# Altium project SD5_Keypad.PrjPcb
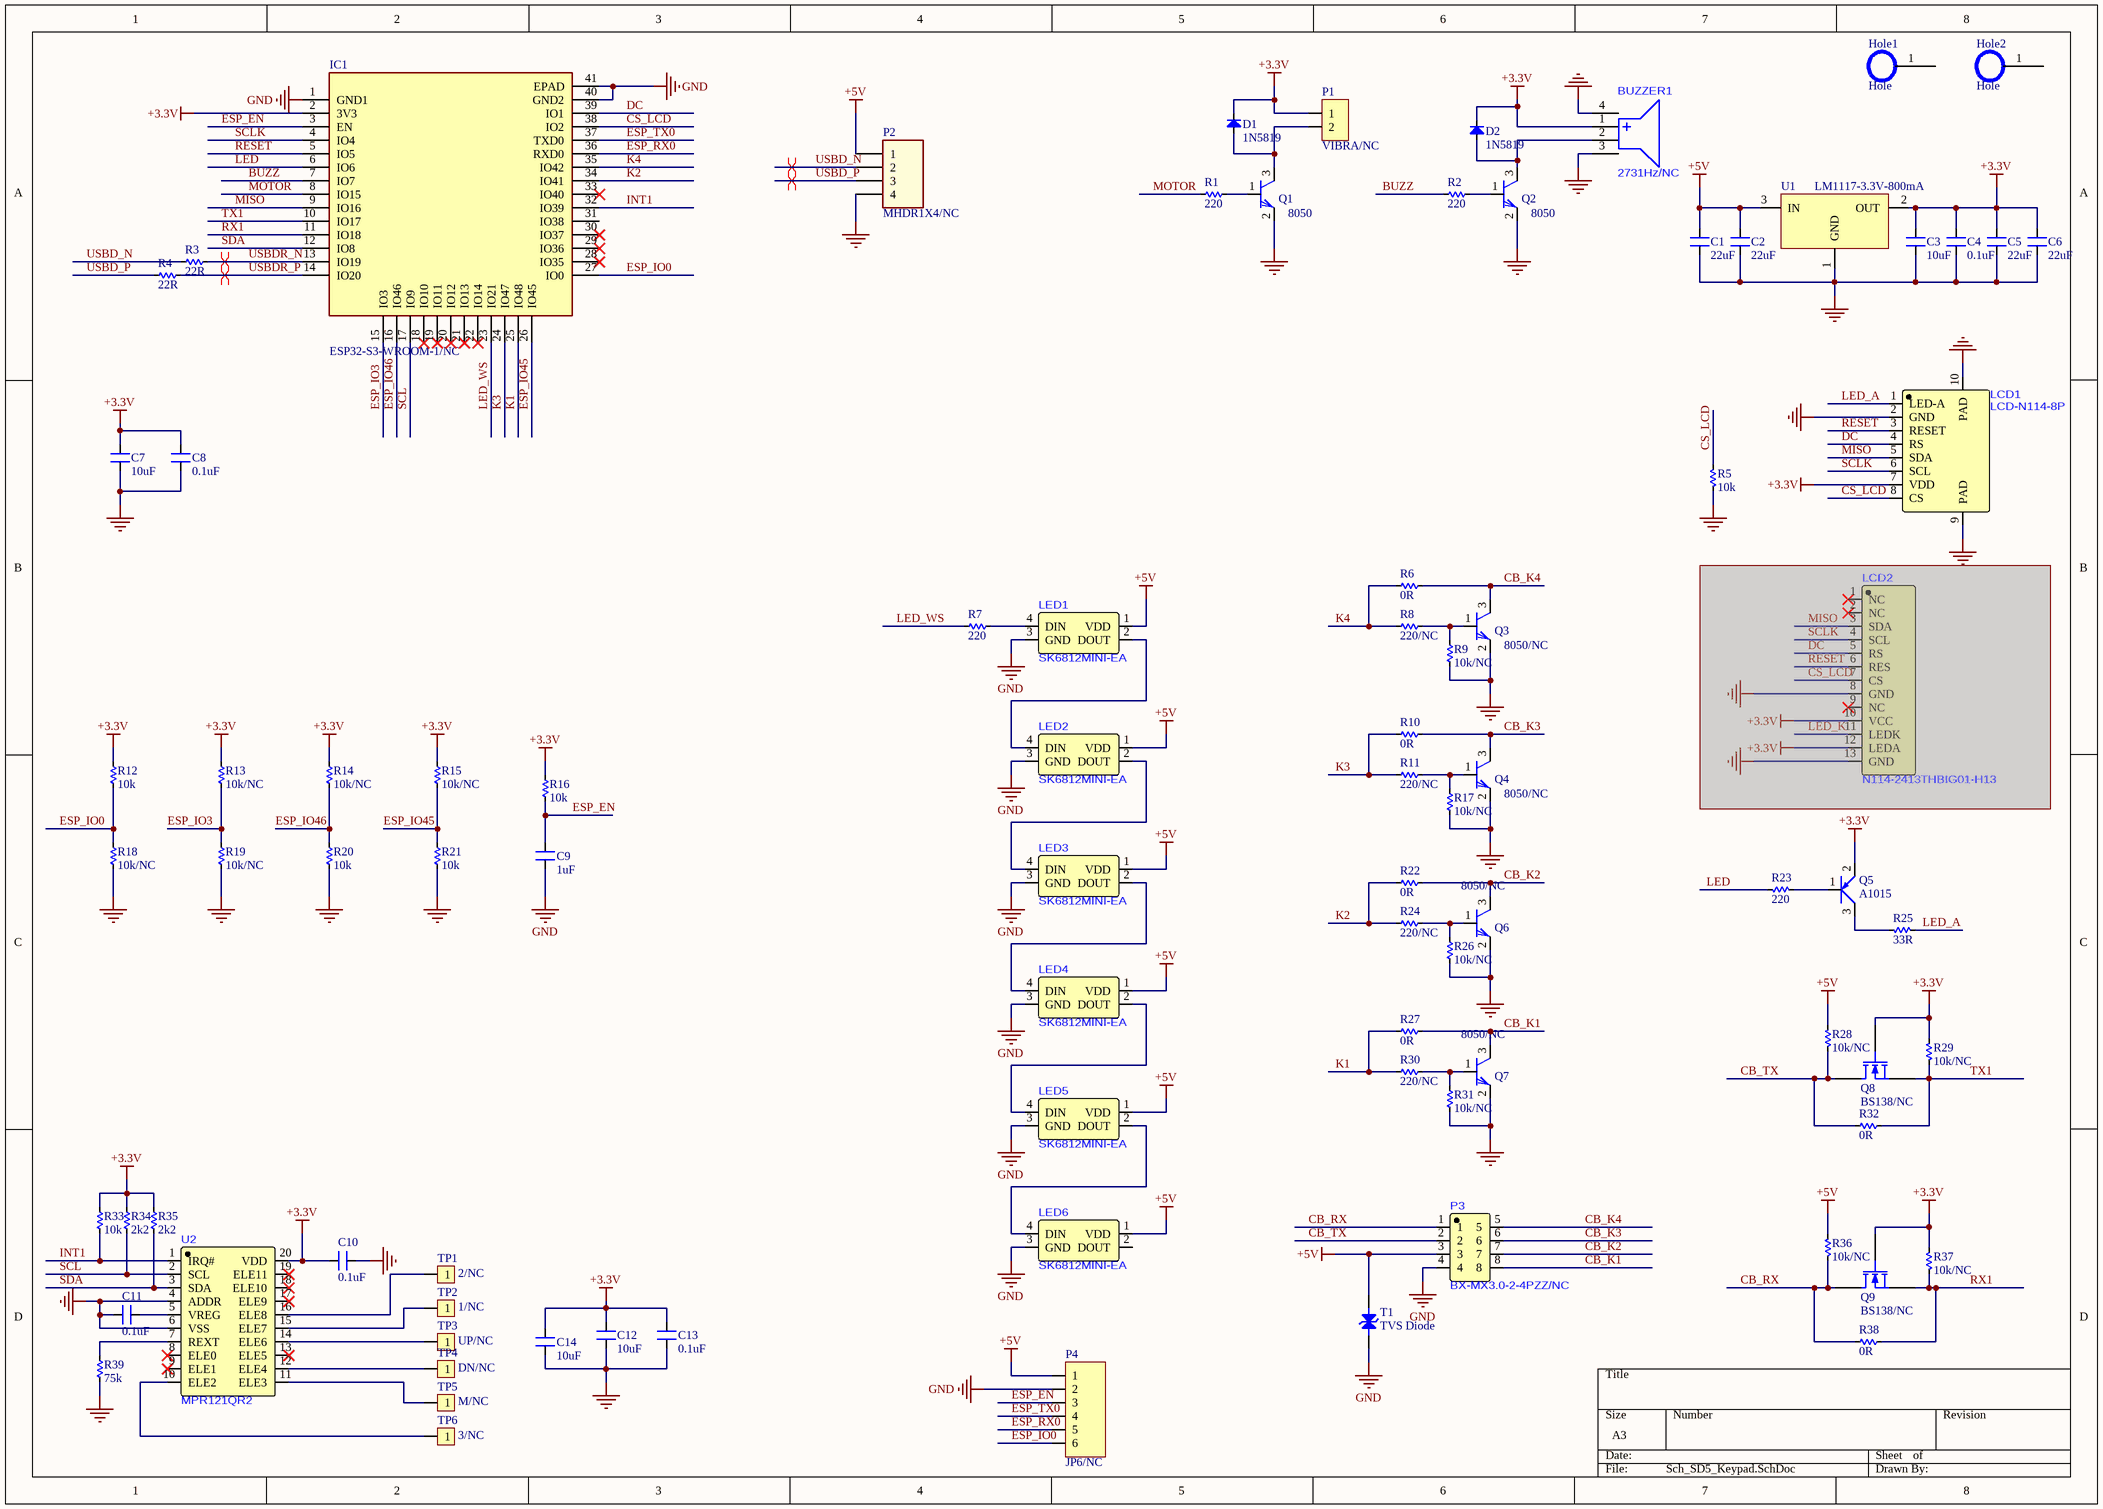
[diagram p0: Sch_SD5_Keypad.SchDoc]
1 sheet, 89 parts. Net scope: global (net labels, ports and power ports of the same name join across sheets).
Board file: PCB_SD5_Keypad_v1.PcbDoc

## Sheet Sch_SD5_Keypad.SchDoc
size A3; SheetNumber: 1; SheetTotal: 1

### Parts
BUZZER1  2731Hz/NC  [BUZ-SMD_4P-L8.5-W8.5-P8.50-TL]
C1  22uF  [C-1206]
C2  22uF  [C-1206]
C3  10uF  [C-0603-2]
C4  0.1uF  [C-0603-2]
C5  22uF  [C-1206]
C6  22uF  [C-1206]
C7  10uF  [C-0603-2]
C8  0.1uF  [C-0603-2]
C9  1uF  [C-0603-2]
C10  0.1uF  [C-0603-2]
C11  0.1uF  [C-0603-2]
C12  10uF  [C-0603-2]
C13  0.1uF  [C-0603-2]
C14  10uF  [C-0603-2]
D1  1N5819  [SOD-123_L2.7-W1.7-LS3.8-RD]
D2  1N5819  [SOD-123_L2.7-W1.7-LS3.8-RD]
Hole1  Hole  [HOLE 2.6mm]
Hole2  Hole  [HOLE 2.6mm]
IC1  ESP32-S3-WROOM-1/NC  [ESP32S3WROOM1N8R2]
LCD1  LCD-N114-8P  [LCD-SMD_1.14IPS-LCD - 8PIN]
LCD2  N114-2413THBIG01-H13  [LCD-SMD_1.14IPS-LCD - 2]  (masked out: inside a compile mask, not in the netlist)
LED1  SK6812MINI-EA  [LED-SMD_4P-L3.2-W2.8_SK6812MINI-EA]
LED2  SK6812MINI-EA  [LED-SMD_4P-L3.2-W2.8_SK6812MINI-EA]
LED3  SK6812MINI-EA  [LED-SMD_4P-L3.2-W2.8_SK6812MINI-EA]
LED4  SK6812MINI-EA  [LED-SMD_4P-L3.2-W2.8_SK6812MINI-EA]
LED5  SK6812MINI-EA  [LED-SMD_4P-L3.2-W2.8_SK6812MINI-EA]
LED6  SK6812MINI-EA  [LED-SMD_4P-L3.2-W2.8_SK6812MINI-EA]
P1  VIBRA/NC  [PAD 2.54]
P2  MHDR1X4/NC  [HDR1X4]
P3  BX-MX3.0-2-4PZZ/NC  [CONN-TH_8P-P3.00_BX-MX3.0-2-4PZZ]
P4  JP6/NC  [JP6-D1T]
Q1  8050  [SOT-23-V2]
Q2  8050  [SOT-23-V2]
Q3  8050/NC  [SOT-23-V2]
Q4  8050/NC  [SOT-23-V2]
Q5  A1015  [SOT-23-V2]
Q6  8050/NC  [SOT-23-V2]
Q7  8050/NC  [SOT-23-V2]
Q8  BS138/NC  [SOT-23-V2]
Q9  BS138/NC  [SOT-23-V2]
R1  220  [R-0603-2]
R2  220  [R-0603-2]
R3  22R  [R-0603-2]
R4  22R  [R-0603-2]
R5  10k  [R-0603-2]
R6  0R  [R-0603-2]
R7  220  [R-0603-2]
R8  220/NC  [R-0603-2]
R9  10k/NC  [R-0603-2]
R10  0R  [R-0603-2]
R11  220/NC  [R-0603-2]
R12  10k  [R-0603-2]
R13  10k/NC  [R-0603-2]
R14  10k/NC  [R-0603-2]
R15  10k/NC  [R-0603-2]
R16  10k  [R-0603-2]
R17  10k/NC  [R-0603-2]
R18  10k/NC  [R-0603-2]
R19  10k/NC  [R-0603-2]
R20  10k  [R-0603-2]
R21  10k  [R-0603-2]
R22  0R  [R-0603-2]
R23  220  [R-0603-2]
R24  220/NC  [R-0603-2]
R25  33R  [R-0603-2]
R26  10k/NC  [R-0603-2]
R27  0R  [R-0603-2]
R28  10k/NC  [R-0603-2]
R29  10k/NC  [R-0603-2]
R30  220/NC  [R-0603-2]
R31  10k/NC  [R-0603-2]
R32  0R  [R-0603-2]
R33  10k  [R-0603-2]
R34  2k2  [R-0603-2]
R35  2k2  [R-0603-2]
R36  10k/NC  [R-0603-2]
R37  10k/NC  [R-0603-2]
R38  0R  [R-0603-2]
R39  75k  [R-0603-2]
T1  TVS Diode  [SMB_L4.6-W3.6-LS5.3-RD]
TP1  2/NC  [TOUCH PAD - 9mm]
TP2  1/NC  [TOUCH PAD - 9mm]
TP3  UP/NC  [TOUCH PAD - 9mm]
TP4  DN/NC  [TOUCH PAD - 9mm]
TP5  M/NC  [TOUCH PAD - 9mm]
TP6  3/NC  [TOUCH PAD - 9mm]
U1  LM1117-3.3V-800mA  [SOT223-LM1117 - duplicate]
U2  MPR121QR2  [QFN-20_L3.0-W3.0-P0.40-BL]

### Nets
+3.3V: BUZZER1.1(+) C3.2 C4.2 C5.2 C6.2 C7.2 C8.2 C10.2 C12.2 C13.2 C14.2 D1.2(K) D2.2(K) IC1.2(3V3) LCD1.7(VDD) P1.1 Q5.2(E) Q8.1(G) Q9.1(G) R12.1 R13.1 R14.1 R15.1 R16.1 R29.1 R33.1 R34.1 R35.1 R37.1 U1.2(OUT) U2.20(VDD)
+5V: C1.2 C2.2 LED1.1(VDD) LED2.1(VDD) LED3.1(VDD) LED4.1(VDD) LED5.1(VDD) LED6.1(VDD) P2.1 P3.3 P4.1 R28.1 R36.1 T1.1 U1.3(IN)
GND: BUZZER1.3 BUZZER1.4 C1.1 C2.1 C3.1 C4.1 C5.1 C6.1 C7.1 C8.1 C9.1 C10.1 C11.2 C12.1 C13.1 C14.1 IC1.1(GND1) IC1.40(GND2) IC1.41(EPAD) LCD1.2(GND) LCD1.9(PAD) LCD1.10(PAD) LED1.3(GND) LED2.3(GND) LED3.3(GND) LED4.3(GND) LED5.3(GND) LED6.3(GND) P2.4 P3.4 P4.2 Q1.2(E) Q2.2(E) Q3.2(E) Q4.2(E) Q6.2(E) Q7.2(E) R5.2 R9.2 R17.2 R18.2 R19.2 R20.2 R21.2 R26.2 R31.2 R39.2 T1.2 U1.1(GND) U2.4(ADDR) U2.6(VSS)
BUZZ: IC1.7(IO7) R2.2
CB_K1: P3.8 Q7.3(C) R27.1
CB_K2: P3.7 Q6.3(C) R22.1
CB_K3: P3.6 Q4.3(C) R10.1
CB_K4: P3.5 Q3.3(C) R6.1
CB_RX: P3.1 Q9.3(D) R36.2 R38.2
CB_TX: P3.2 Q8.3(D) R28.2 R32.2
CS_LCD: IC1.38(IO2) LCD1.8(CS) R5.1
DC: IC1.39(IO1) LCD1.4(RS)
ESP_EN: C9.2 IC1.3(EN) P4.3 R16.2
ESP_IO0: IC1.27(IO0) P4.6 R12.2 R18.1
ESP_IO3: IC1.15(IO3) R13.2 R19.1
ESP_IO45: IC1.26(IO45) R15.2 R21.1
ESP_IO46: IC1.16(IO46) R14.2 R20.1
ESP_RX0: IC1.36(RXD0) P4.5
ESP_TX0: IC1.37(TXD0) P4.4
INT1: IC1.32(IO39) R33.2 U2.1(IRQ#)
K1: IC1.25(IO48) R27.2 R30.2
K2: IC1.34(IO41) R22.2 R24.2
K3: IC1.24(IO47) R10.2 R11.2
K4: IC1.35(IO42) R6.2 R8.2
LED: IC1.6(IO6) R23.2
LED_A: LCD1.1(LED-A) R25.2
LED_WS: IC1.23(IO21) R7.1
MISO: IC1.9(IO16) LCD1.5(SDA)
MOTOR: IC1.8(IO15) R1.2
RESET: IC1.5(IO5) LCD1.3(RESET)
RX1: IC1.11(IO18) Q9.2(S) R37.2 R38.1
SCL: IC1.17(IO9) R34.2 U2.2(SCL)
SCLK: IC1.4(IO4) LCD1.6(SCL)
SDA: IC1.12(IO8) R35.2 U2.3(SDA)
TX1: IC1.10(IO17) Q8.2(S) R29.2 R32.1
USBD_N: P2.2 R3.2
USBD_P: P2.3 R4.2
USBDR_N: IC1.13(IO19) R3.1
USBDR_P: IC1.14(IO20) R4.1
NetBUZZER1_2: BUZZER1.2(-) D2.1(A) Q2.3(C)
NetC11_1: C11.1 U2.5(VREG)
NetD1_1: D1.1(A) P1.2 Q1.3(C)
NetLED1_2: LED1.2(DOUT) LED2.4(DIN)
NetLED1_4: LED1.4(DIN) R7.2
NetLED2_2: LED2.2(DOUT) LED3.4(DIN)
NetLED3_2: LED3.2(DOUT) LED4.4(DIN)
NetLED4_2: LED4.2(DOUT) LED5.4(DIN)
NetLED5_2: LED5.2(DOUT) LED6.4(DIN)
NetQ1_1: Q1.1(B) R1.1
NetQ2_1: Q2.1(B) R2.1
NetQ3_1: Q3.1(B) R8.1 R9.1
NetQ4_1: Q4.1(B) R11.1 R17.1
NetQ5_1: Q5.1(B) R23.1
NetQ5_3: Q5.3(C) R25.1
NetQ6_1: Q6.1(B) R24.1 R26.1
NetQ7_1: Q7.1(B) R30.1 R31.1
NetR39_1: R39.1 U2.7(REXT)
NetTP1_1: TP1.1 U2.16(ELE8)
NetTP2_1: TP2.1 U2.15(ELE7)
NetTP3_1: TP3.1 U2.14(ELE6)
NetTP4_1: TP4.1 U2.12(ELE4)
NetTP5_1: TP5.1 U2.11(ELE3)
NetTP6_1: TP6.1 U2.10(ELE2)

Not connected (* = marked no-connect by the designer): Hole1 1; Hole2 1; IC1 18(IO10)* 19(IO11)* 20(IO12)* 21(IO13)* 22(IO14)* 28(IO35)* 29(IO36)* 30(IO37)* 31(IO38) 33(IO40)*; LED6 2(DOUT); U2 8(ELE0)* 9(ELE1)* 13(ELE5)* 17(ELE9)* 18(ELE10)* 19(ELE11)*

### Layout directives
differential pair: USBD_N, USBD_P, USBDR_N, USBDR_P

### Notes on the sheet
- Labels drawn without touching a wire or pin: \

### Library data of the parts
BUZZER1 = KLJ-7525-3627
C1 C2 C5 C6 = CN: MPN: CL31A226KAHNNNE; Value: 33pF; LCSC: C12891
C3 C7 C12 C14 = CN: MPN: CL10A106KP8NNNC; Value: 33pF; LCSC: C19702
C4 C8 C10 C11 C13 = CN: MPN: CC0603KRX7R9BB104; Value: 33pF; LCSC: C14663
C9 = CN: MPN: CL10A105KB8NNNC; Value: 33pF; LCSC: C15849
D1 D2 = Diode SMD: Default Diode; MPN: 1N5819HW-7-F; Code - JEDEC: DO-214-AB; Value: 1N5007; Published: 8-Jun-2000; Revision: July-2002: Re-released for DXP Platform.; Publisher: Altium Limited; LCSC: C82544
IC1 = ESP32-S3-WROOM-1: Integrated Circuit; Manufacturer_Name: Espressif Systems; Manufacturer_Part_Number: ESP32-S3-WROOM-1-N8R2; Datasheet Link: https://www.mouser.com/catalog/specsheets/Espressif_ESP32_S3_WROOM_1_1U_Preliminary.pdf; Height: 3.25mm; Mouser Part Number: 356-ESP32-S3WRM1N8R2; Mouser Price/Stock: https://www.mouser.co.uk/ProductDetail/Espressif-Systems/ESP32-S3-WROOM-1-N8R2?qs=Wj%2FVkw3K%252BMCC1Ha9x85iJA%3D%3D; LCSC: C2913204; MPN: ESP32-S3-WROOM-1-N8R2
LCD1 = LCD-N114-8P: MPN: AFC07-S08FCA-00; LCSC: C262555
P1 = JP2: WR-PHD 2.54 mm Angled Socket Header; Manufacturer: W¨¹rth Elektronik eiSos GmbH; partNo: 613002143121; ComponentLink1 Description: Manufacturer; ComponentLink2 Description: Datasheet; NoPins: 02; Created Date: 29 March 2013; ComponentLink1URL: http://www.we-online.com; ComponentLink2URL: http://katalog.we-online.de/em/datasheet/6130xx143121.pdf; Created by: Karrer Zheng
P2 = MHDR1X4: Header, 4-Pin; LatestRevisionDate: 17-Jul-2002; LatestRevisionNote: Re-released for DXP Platform.; Publisher: Altium Limited
P3 = BX-MX3.0-2-4PWZ: LCSC: C18078308; MPN: BX-MX3.0-2-4PZZ
P4 = JP6: WR-PHD 2.54 mm Angled Socket Header; Manufacturer: W¨¹rth Elektronik eiSos GmbH; partNo: 613006143121; ComponentLink1 Description: Manufacturer; ComponentLink2 Description: Datasheet; NoPins: 06; Created Date: 29 March 2013; ComponentLink1URL: http://www.we-online.com; ComponentLink2URL: http://katalog.we-online.de/em/datasheet/6130xx143121.pdf; Created by: Karrer Zheng
Q1 Q3 Q4 Q6 Q7 = C1815: MPN: S8050; COMPONENT: 2SC1815; PSpiceTemplate: Q^@REFDES %c %b %e @MODEL; Vendor: Digikey; Published: 13-April-2009; Publisher: Hoang Nguyen; ComponentLink1Description: Digikey Part Link; ComponentLink2Description: Open Datasheet; ComponentLink2URL: H:\LIBRARY\LIBRARY.Datasheet\; Price: 500VND; LCSC: C111272
Q2 = C1815: Q2SC1815; MPN: S8050; PSpiceTemplate: Q^@REFDES %c %b %e @MODEL; Vendor: Digikey; COMPONENT: 2SC1815; Published: 13-April-2009; Publisher: Hoang Nguyen; ComponentLink1Description: Digikey Part Link; ComponentLink2Description: Open Datasheet; ComponentLink2URL: H:\LIBRARY\LIBRARY.Datasheet\; Price: 500VND; LCSC: C111272
Q5 = A1015: PNP SOT 23; MPN: 2SA1015; Value: A1015; LCSC: C545569
Q8 Q9 = Si2302DS: N-Channel MOSFET; MPN: BSS138W-7-F; Published: 8-Jun-2000; LatestRevisionDate: 17-Jul-2002; LatestRevisionNote: Re-released for DXP Platform.; PackageVersion: 1995/1996; PackageReference: E3; Publisher: Altium Limited; PackageDescription: TO, Flat Index; 3 In-Line, Axial Leads; Body Dia. 4.6mm; Lead Dia. 0.5 mm (max); LCSC: C24553
R1 R2 R7 R8 R11 R23 R24 R30 = Res-SMD: Resistor; Manufacturer: Generic Components; MPN: 0603WAJ0221T5E; Class: Passive; Published: 08/06/2000; Publisher: Altium Hobart Technology Centre; LCSC: C1226
R3 R4 = Res-SMD: Resistor; Manufacturer: Generic Components; MPN: 0603WAJ0220T5E; Class: Passive; Published: 08/06/2000; Publisher: Altium Hobart Technology Centre; LCSC: C1203
R5 R9 R12-R21 R26 R28 R29 R31 R33 R36 R37 = Res-SMD: Resistor; Manufacturer: Generic Components; MPN: 0603WAJ0103T5E; Class: Passive; Published: 08/06/2000; Publisher: Altium Hobart Technology Centre; LCSC: C15401
R6 R10 R22 R27 R32 R38 = Res-SMD: Resistor; Manufacturer: Generic Components; MPN: 0603WAJ0000T5E; Class: Passive; Published: 08/06/2000; Publisher: Altium Hobart Technology Centre; LCSC: C15402
R25 = Res-SMD: Resistor; Manufacturer: Generic Components; MPN: 0603WAF330JT5E; Class: Passive; Published: 08/06/2000; Publisher: Altium Hobart Technology Centre; LCSC: C23140
R34 R35 = Res-SMD: Resistor; Manufacturer: Generic Components; MPN: 0603WAF2201T5E; Class: Passive; Published: 08/06/2000; Publisher: Altium Hobart Technology Centre; LCSC: C4190
R39 = Res-SMD: Resistor; Manufacturer: Generic Components; MPN: 0603WAJ0753T5E; Class: Passive; Published: 08/06/2000; Publisher: Altium Hobart Technology Centre; LCSC: C18671
T1 = TVS Diode: MPN: SMBJ5.0A; LCSC: C10204
TP1-TP6 = JP1: WR-PHD 2.54 mm Angled Socket Header; Manufacturer: W¨¹rth Elektronik eiSos GmbH; partNo: 613002143121; ComponentLink1 Description: Manufacturer; ComponentLink2 Description: Datasheet; NoPins: 02; Created Date: 29 March 2013; ComponentLink1URL: http://www.we-online.com; ComponentLink2URL: http://katalog.we-online.de/em/datasheet/6130xx143121.pdf; Created by: Karrer Zheng
U1 = LM1117: 800mA Low-Dropout Linear Regulator; MPN: LM1117MPX-3.3/NOPB; Creator: Nguyen Ba Bien; Website: http://group3i.net; LCSC: C9662
LED1-LED6 = SK6812MINI-EA: LCSC: C5378731; MPN: SK6812MINI-EA
U2 = MPR121QR2: LCSC: C91322; MPN: MPR121QR2